# EAGLE design SHIELD_PROMINI (EAGLE 9.6.2)
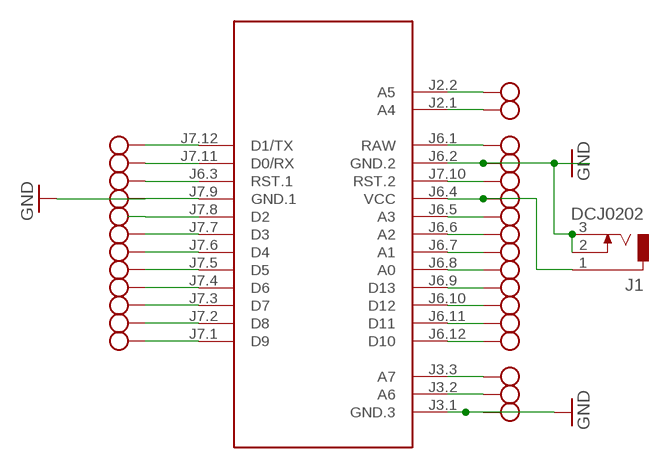
[diagram p0: schematic, sheet 1]

## Parts
J1  DCJ0202  [DCJ0202]
M1  ARDUINO-PRO-MINI-5.0V#NP  [ARDUINO-PRO-MINI#NP]
X1  AK300/12  [AK300/12]
X2  AK300/12  [AK300/12]
X3  AK300/5  [AK300/5]

## Nets
GND: J1.2 J1.3 M1.J3.1(GND.3) M1.J6.2(GND.2) M1.J7.9(GND.1) X1.9 X2.2 X3.3
N$1: M1.J7.12(D1/TX) X1.12
N$2: M1.J7.11(D0/RX) X1.11
N$3: M1.J7.4(D6) X1.4
N$4: M1.J7.2(D8) X1.2
N$5: M1.J7.8(D2) X1.8
N$6: M1.J7.7(D3) X1.7
N$7: M1.J7.6(D4) X1.6
N$8: M1.J7.5(D5) X1.5
N$9: M1.J7.3(D7) X1.3
N$10: M1.J7.1(D9) X1.1
N$11: M1.J7.10(RST.2) X1.10
N$13: M1.J6.1(RAW) X2.1
N$15: M1.J6.3(RST.1) X2.3
N$16: J1.1 M1.J6.4(VCC) X2.4
N$17: M1.J6.5(A3) X2.5
N$18: M1.J6.6(A2) X2.6
N$19: M1.J6.7(A1) X2.7
N$20: M1.J6.8(A0) X2.8
N$21: M1.J6.9(D13) X2.9
N$22: M1.J6.10(D12) X2.10
N$23: M1.J6.11(D11) X2.11
N$24: M1.J6.12(D10) X2.12
N$25: M1.J2.2(A5) X3.5
N$26: M1.J2.1(A4) X3.4
N$28: M1.J3.2(A6) X3.2
N$29: M1.J3.3(A7) X3.1

## Library data of the parts
J1 = con-jack:DCJ0202: DC POWER JACK Source: DCJ0202.pdf; OC_FARNELL: unknown; OC_NEWARK: unknown
M1 = diy-modules:ARDUINO-PRO-MINI-*#NP: Arduino Pro Mini (and compatible devices) without programming pads More details available here: https://www.arduino.cc/en/Main/ArduinoBoardProMini Click here to find device on ebay.com <http://www.ebay.com/sch/arduino+pro+mini>
X1 X2 = con-ptr500:AK300/12: CONNECTOR; OC_FARNELL: unknown; OC_NEWARK: unknown
X3 = con-ptr500:AK300/5: CONNECTOR; OC_FARNELL: unknown; OC_NEWARK: unknown

## Board
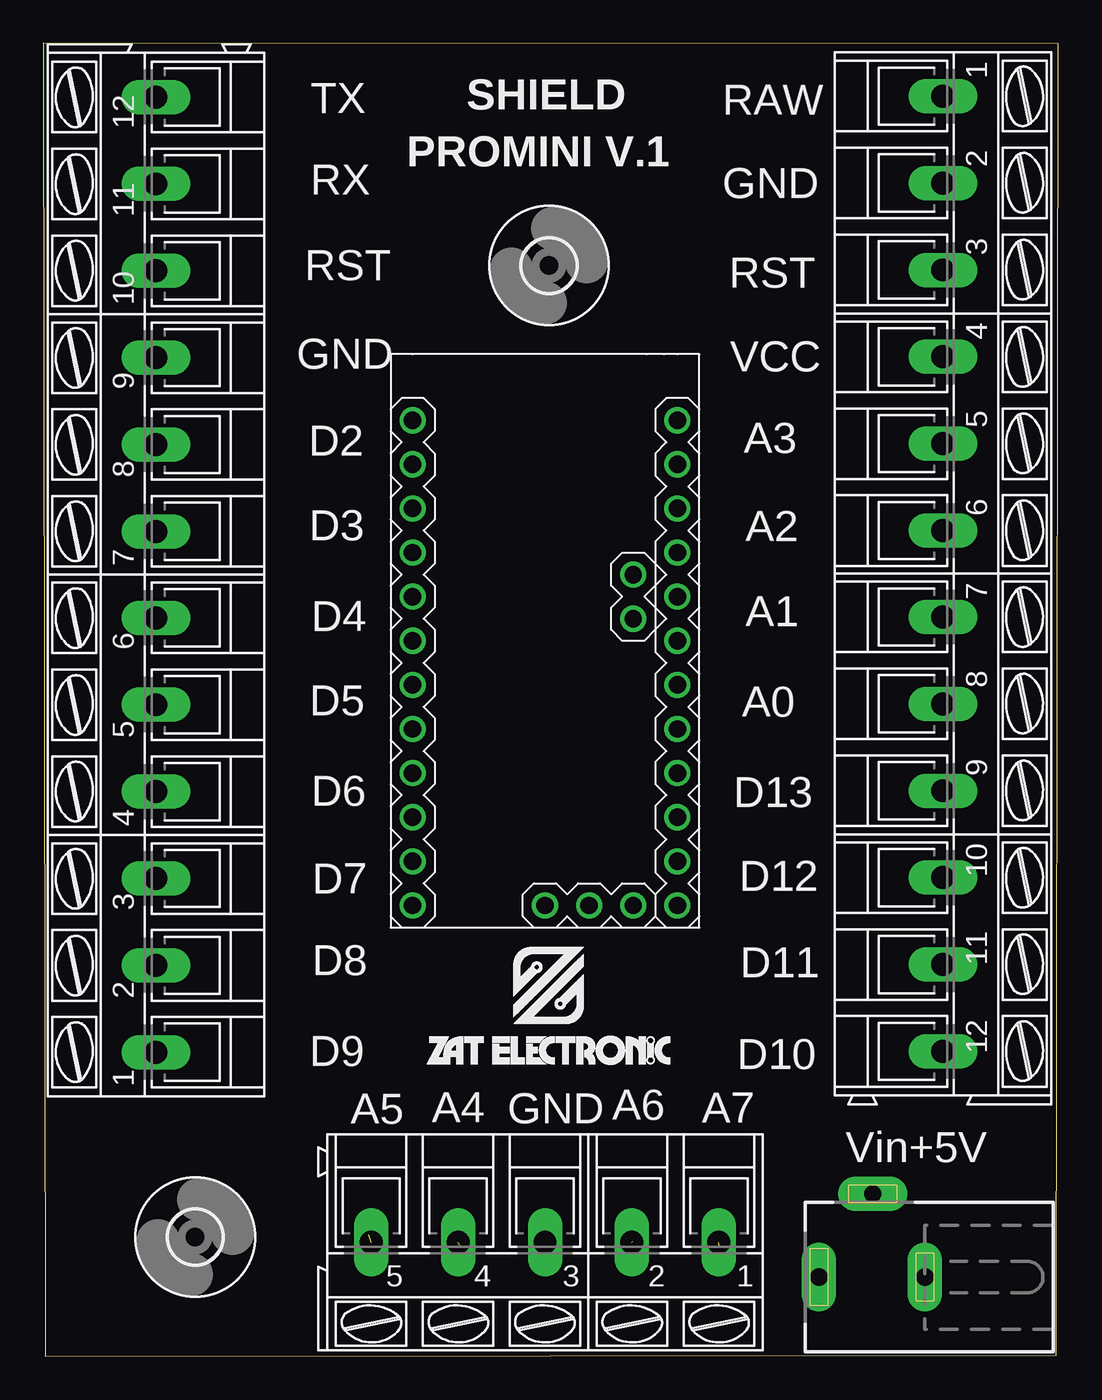
[diagram p1: board, top side]
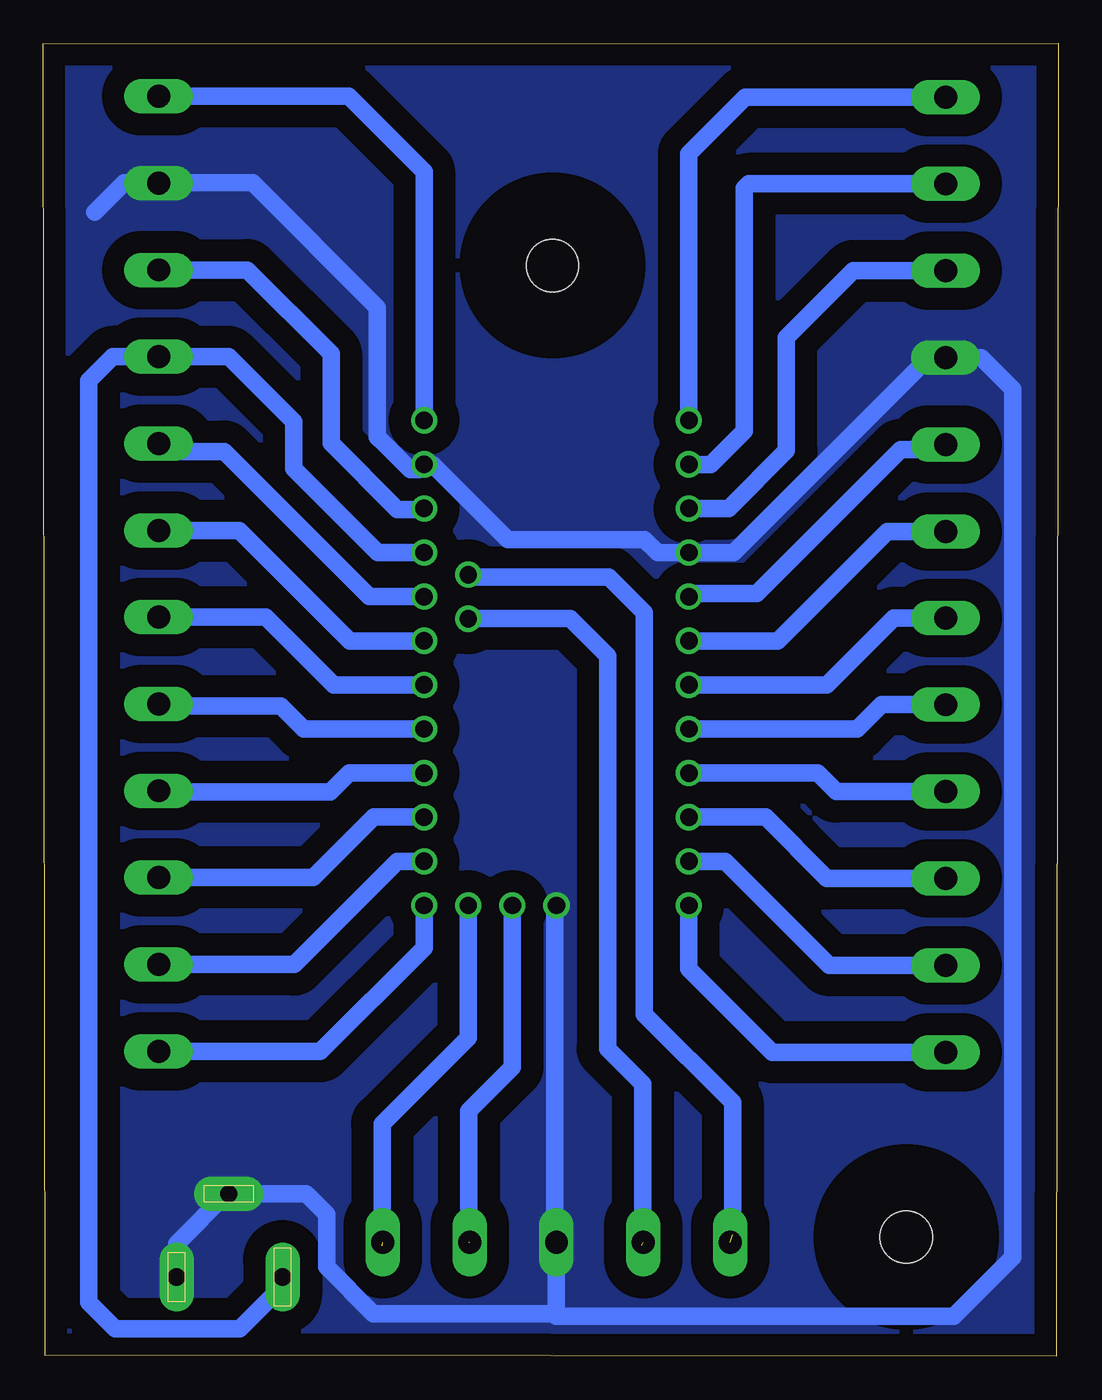
[diagram p2: board, bottom side, seen from below]

Size 58.42 x 75.61 mm. Coordinates in mm from the lower left corner, seen from the top.
Outline: 0.1,0 58.32,0.05 58.42,75.58 0,75.61 0.1,0
Copper layers (1*16): Top 0.035mm / dielectric 1.5mm / Bottom 0.035mm
Design rules "default *": minimum track width 40mil, minimum drill 0.35mm, track to track 40mil, track to pad 6mil, pad to pad 6mil, via to via 6mil, smd to smd 6mil, copper to edge 40mil, drill to drill 40mil, minimum pad ring 10mil, minimum via ring 8mil, stop-mask expansion 4mil, vias tented up to drill 0mil, thermal gap 10mil

### Footprints (pad centres in the part's own frame; a part is rotated, then mirrored left to right if it is on the bottom)
DCJ0202 = drill 1 pad 2 long: 1 0,3.1; 2 4.8,0; 3 0,-3
ARDUINO-PRO-MINI#NP = drill 1: J2.1 -1.27,5.08; J2.2 -3.81,5.08; J3.1 15.24,0; J3.2 15.24,2.54; J3.3 15.24,5.08; J6.1 -12.7,7.62; J6.2 -10.16,7.62; J6.3 -7.62,7.62; J6.4 -5.08,7.62; J6.5 -2.54,7.62; J6.6 0,7.62; J6.7 2.54,7.62; J6.8 5.08,7.62; J6.9 7.62,7.62; J6.10 10.16,7.62; J6.11 12.7,7.62; J6.12 15.24,7.62; J7.1 15.24,-7.62; J7.2 12.7,-7.62; J7.3 10.16,-7.62; J7.4 7.62,-7.62; J7.5 5.08,-7.62; J7.6 2.54,-7.62; J7.7 0,-7.62; J7.8 -2.54,-7.62; J7.9 -5.08,-7.62; J7.10 -7.62,-7.62; J7.11 -10.16,-7.62; J7.12 -12.7,-7.62
3,0 = hole 3: 0,0
AK300/12 = drill 1.321 long: 1 -27.508,0; 2 -22.504,0; 3 -17.501,0; 4 -12.497,0; 5 -7.493,0; 6 -2.489,0; 7 2.489,0; 8 7.493,0; 9 12.497,0; 10 17.501,0; 11 22.504,0; 12 27.508,0
AK300/5 = drill 1.321 long: 1 -10.008,0; 2 -5.004,0; 3 0,0; 4 5.004,0; 5 10.008,0

### Placement (x,y rotation side)
J1  47.75,4.55 90 top
M1  28.88,41.2 270 top
U$1  [ZAT_ESCRITA_0.5]  21.84,16.54 0 top
U$2  [3,0]  29.11,62.81 0 top
U$3  [3,0]  8.74,6.86 0 top
X1  6.48,45.01 90 top
X2  51.79,45.06 270 top
X3  28.88,6.55 180 top

### Tracks (layer width: path | path; a pad name or v marks a point on that pad's centre or on a via)
GND
  Bottom 0.152: 39.19,60.4 38.86,60.07 38.86,52.6 | J1.2 47.75,9.45 47.78,9.45
  Bottom 1.016: 36.8,51.05 37.31,51.05 38.86,52.6 39.19,52.93 39.19,60.4 46.38,67.59 51.76,67.59 | 51.76,67.59 53.77,67.59 55.47,65.89 | M1.J3.1 28.98,25.86 28.98,6.32 28.96,6.3 | M1.J6.2 36.02,51.36 31.7,47.04 23.82,47.04 23.06,46.28 M1.J7.9 18.67,46.28 7.44,57.51 X1.9 4.42,57.51 2.62,55.7 2.62,5.69 6.02,2.29 28.88,2.29 X3.3 28.88,2.44 39.42,2.44 42.11,5.13 42.11,8.18 43.28,9.35 J1.2 | X2.2 51.76,67.59 | J1.3 50.75,6.47 47.78,9.45 47.4,9.83
  pour Bottom (isolate 1.27, no thermals): 0.15,75.49 58.29,75.49 58.29,0.08 0.15,0.08 0.15,75.46
N$1
  Bottom 1.016: X1.12 18.01,72.52 21.26,69.27 M1.J7.12
N$2
  Bottom 1.016: X1.11 17.81,67.51 18.06,67.26 18.06,53.29 19.99,51.36 M1.J7.11
N$3
  Bottom 1.016: X1.4 12.78,32.51 13.84,33.58 M1.J7.4
N$4
  Bottom 1.016: X1.2 13.18,22.5 19.18,28.5 M1.J7.2
N$5
  Bottom 1.016: X1.8 6.78,52.2 9.07,52.2 17.35,43.92 21.08,43.92 M1.J7.8
N$6
  Bottom 1.016: X1.7 9.83,47.5 16.13,41.2 M1.J7.7
N$7
  Bottom 1.016: X1.6 9.45,42.52 13.31,38.66 M1.J7.6
N$8
  Bottom 1.016: X1.5 10.16,37.52 11.56,36.12 M1.J7.5
N$9
  Bottom 1.016: X1.3 13.31,27.51 16.84,31.04 M1.J7.3
N$10
  Bottom 1.016: X1.1 16.46,17.5 21.26,22.3 M1.J7.1
N$11
  Bottom 1.016: M1.J7.10 18.97,48.82 15.65,52.15 15.65,58.65 11.79,62.51 X1.10
N$13
  Bottom 1.016: X2.1 40.84,72.57 36.5,68.22 M1.J6.1
N$15
  Bottom 1.016: X2.3 46.68,62.56 41.86,57.73 41.86,52.58 38.05,48.77 36.55,48.77 M1.J6.3
N$16
  Bottom 0.813: J1.1 44.65,4.04 45.19,3.5 47.19,1.5 54.28,1.5
  Bottom 1.016: M1.J6.4 39.17,46.28 44.02,51.13 44.02,53.82 47.75,57.56 X2.4 54.43,57.56 55.8,56.18 55.8,3.1 54.28,1.57 47.12,1.57 45.19,3.5
N$17
  Bottom 1.016: M1.J6.5 39.65,43.74 48.02,52.11 51.35,52.11 X2.5
N$18
  Bottom 1.016: X2.6 47.14,47.55 40.79,41.2 M1.J6.6
N$19
  Bottom 1.016: M1.J6.7 41.71,38.66 45.62,42.57 X2.7
N$20
  Bottom 1.016: M1.J6.8 43.43,36.12 44.75,37.44 51.66,37.44 X2.8
N$21
  Bottom 1.016: M1.J6.9 40.82,33.58 41.91,32.49 51.71,32.49 X2.9
N$22
  Bottom 1.016: M1.J6.10 39.4,31.04 42.87,27.56 X2.10
N$23
  Bottom 1.016: M1.J6.11 38.05,28.5 43.99,22.55 X2.11
N$24
  Bottom 1.016: M1.J6.12 36.5,23.52 42.47,17.55 X2.12
N$25  (1 unrouted)
  Bottom 1.016: M1.J2.2 33.81,44.86 25.86,44.86 23.82,42.82 23.82,19.68 18.74,14.6 18.74,6.98
N$26  (1 unrouted)
  Bottom 1.016: M1.J2.1 28.09,42.47 25.93,40.31 25.93,17.7 23.9,15.67 23.9,6.45 23.98,6.38
N$28  (1 unrouted)
  Bottom 1.016: M1.J3.2 31.42,16.64 33.93,14.12 33.93,6.58
N$29  (1 unrouted)
  Bottom 1.016: M1.J3.3 33.96,18.34 38.91,13.39 38.91,6.35

### Text on the board
tPlace: TX | SHIELD | RAW | PROMINI V.1 | RX | GND | RST | RST | GND | VCC | D2 | A3 | D3 | A2 | A1 | D4 | D5 | A0 | D6 | D13 | D7 | D12 | D8 | D11 | D9 | D10 | A5 | A4 | GND | A6 | A7 | Vin+5V